# EAGLE design Calunium_PSU_v1 (EAGLE 6.4)
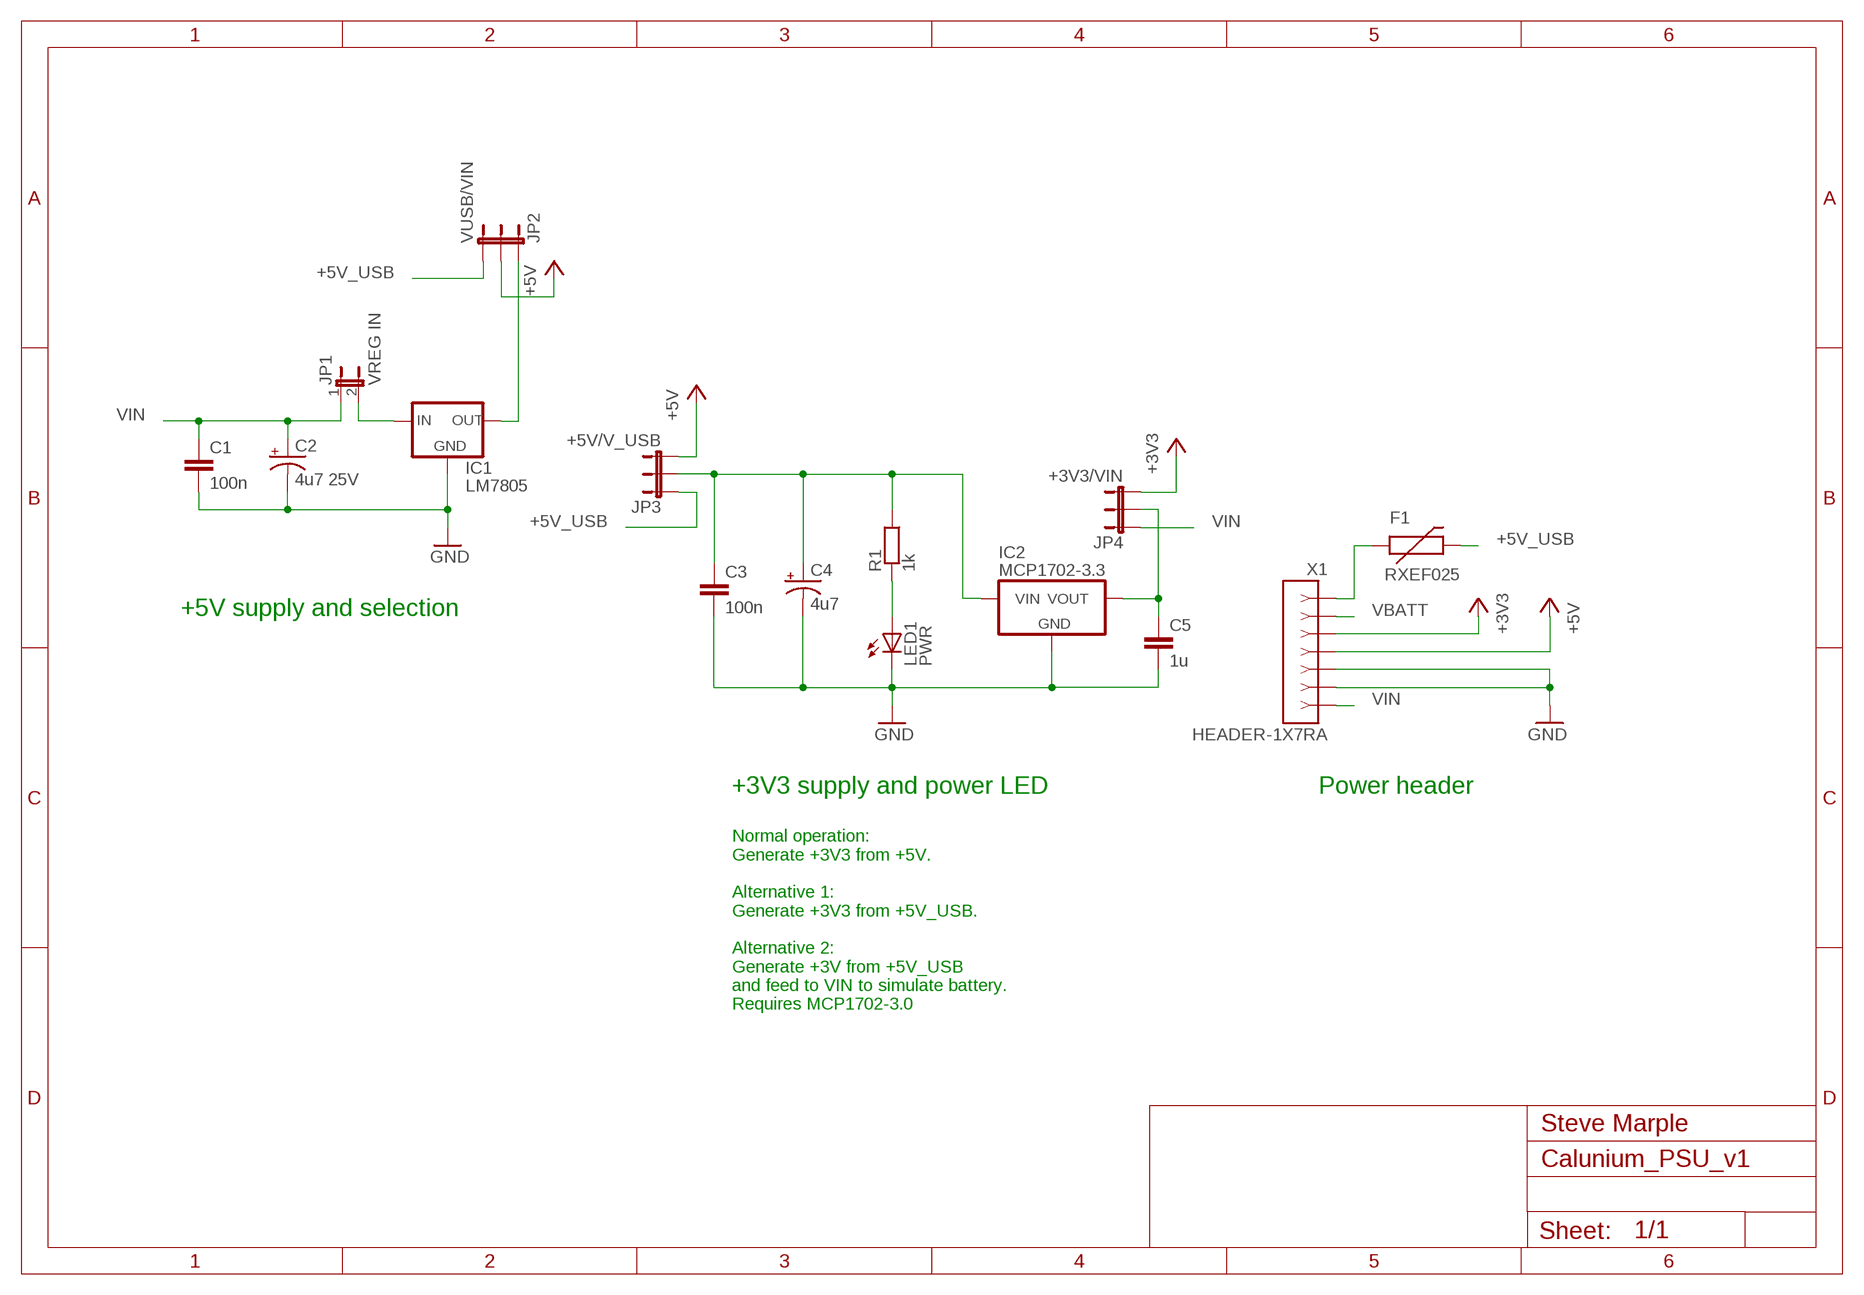
[diagram p0: schematic, sheet 1]

## Parts
C1  100n  CAPPTH  [CAP-PTH-SMALL]
C2  4u7 25V  CAP_POLPTH2  [CPOL-RADIAL-10UF-25V]
C3  100n  CAPPTH  [CAP-PTH-SMALL]
C4  4u7  CAP_POLPTH2  [CPOL-RADIAL-10UF-25V]
C5  1u  CAPPTH1  [CAP-PTH-5MM]
F1  RXEF025  PTCPTH  [PTC]
IC1  LM7805  V_REG_78XXSIDE-NO-HOLE  [78XXL-NO-HOLE]
IC2  MCP1702-3.3  MCP1702  [TO-92]
JP1  VREG IN  JUMPER-2PTH  [1X02]
JP2  VUSB/VIN  JUMPER-3PTH  [1X03]
JP3  +5V/V_USB  JUMPER-3SMD  [SJ_3]
JP4  +3V3/VIN  JUMPER-3SMD  [SJ_3]
LED1  PWR  LED3MM  [LED3MM]
R1  1k  RESISTOR  [RES-AXIAL-0.4]
X1  HEADER-1X7RA  [HEADER-1X7-RA]

## Nets
+3V3 [power]: JP4.3 X1.3
+5V [power]: JP2.2 JP3.3 X1.4
+5V_USB [power]: F1.P$2 JP2.3 JP3.1
GND [power]: C1.2 C2.2(-) C3.2 C4.2(-) C5.2 IC1.GND IC2.1(GND) LED1.K(C) X1.5 X1.6
N$1 [power]: F1.P$1 X1.1
N$2 [power]: IC1.IN JP1.2
N$3 [power]: IC1.OUT JP2.1
N$4 [power]: C3.1 C4.1(+) IC2.2(VIN) JP3.2 R1.P$2
N$5 [power]: C5.1 IC2.3(VOUT) JP4.2
N$8: LED1.A R1.P$1
VBATT [power]: X1.2
VIN [power]: C1.1 C2.1(+) JP1.1 JP4.1 X1.7

## Notes on the sheet
- +5V supply and selection
- +3V3 supply and power LED | Power header
- Normal operation:
  Generate +3V3 from +5V.
  
  Alternative 1:
  Generate +3V3 from +5V_USB.
  
  Alternative 2:
  Generate +3V from +5V_USB
  and feed to VIN to simulate battery.
  Requires MCP1702-3.0
- Steve Marple

## Library data of the parts
C1 C3 C5 = SparkFun:CAP: Capacitor Standard 0603 ceramic capacitor, and 0.1" leaded capacitor.
C2 C4 = SparkFun:CAP_POL: Capacitor Polarized These are standard SMD and PTH capacitors. Normally 10uF, 47uF, and 100uF in electrolytic and tantalum varieties. Always verify the external diameter of the through hole cap, it varies with capacity, voltage, and manufacturer. The EIA devices should be standard.
F1 = SparkFun:PTC: Resettable Fuse PTC Resettable Fuse. Spark Fun Electronics SKU : COM-08357
IC1 = SteveMarple:V_REG_78XX: Voltage Regulator Standard 7805 5V regulator. IGO (Input Ground Output). Spark Fun Electronics SKU : COM-00107
IC2 = SteveMarple:MCP1702: Microchip MCP1702 250mA loq quiescent current (2uA) LDO voltage regulator.
JP1 = SparkFun:JUMPER-2: Jumper Basic 0.1" spaced jumper. Use with breakaway headers.
JP2-JP4 = SparkFun:JUMPER-3
LED1 = SparkFun:LED: LEDs Standard schematic elements and footprints for 5mm, 3mm, 1206, and 0603 sized LEDs. 5mm - Spark Fun Electronics SKU : COM-00529 (and others)
R1 = SteveMarple:RESISTOR: 1/4W PTH resistor
X1 = SteveMarple:HEADER-1X7

## Net classes
1 power: width 0.381 mm
3 antenna: width 0.61 mm

## Board
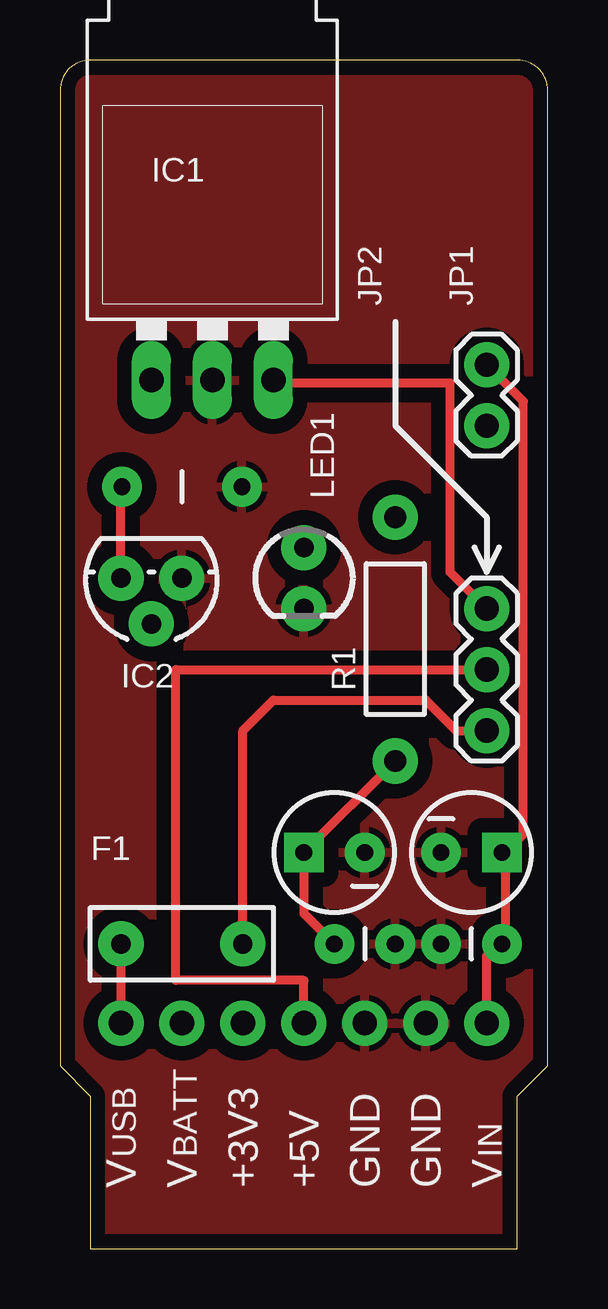
[diagram p1: board, top side]
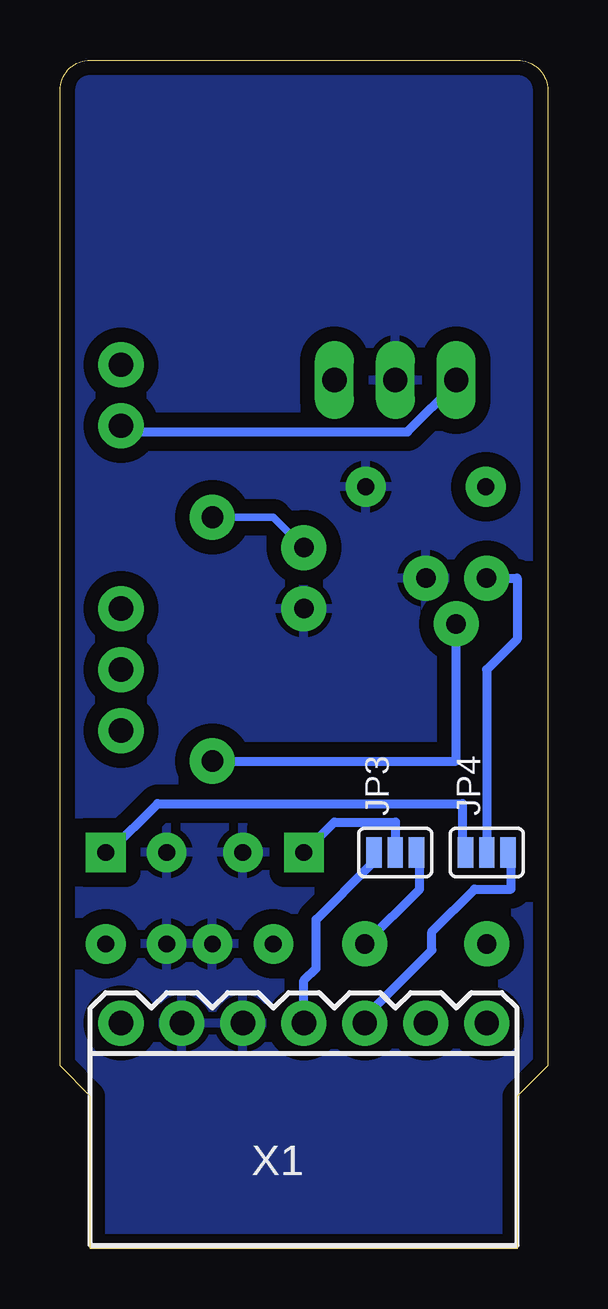
[diagram p2: board, bottom side, seen from below]

Size 20.32 x 49.53 mm. Coordinates in mm from the lower left corner, seen from the top.
Outline: 1.27,0 19.05,0 19.05,6.35 20.32,7.62 20.32,48.26 arc90 19.05,49.53 1.27,49.53 arc90 0,48.26 0,7.62 1.27,6.35 1.27,0
Copper layers (1*16): Top 0.035mm / dielectric 1.5mm / Bottom 0.035mm
Design rules "SparkFun_Iteadstudio_10mil": minimum track width 10mil, minimum drill 20mil, track to track 10mil, track to pad 10mil, pad to pad 10mil, via to via 10mil, smd to smd 10mil, copper to edge 0.5mm, drill to drill 8mil, minimum pad ring 12mil, minimum via ring 10mil, stop-mask expansion 4mil, vias tented up to drill 25mil, thermal gap 10mil

### Footprints (pad centres in the part's own frame; a part is rotated, then mirrored left to right if it is on the bottom)
CAP-PTH-SMALL = drill 0.7 pad 1.651: 1 0,0; 2 2.54,0
CPOL-RADIAL-10UF-25V = drill 0.7 pad 1.651 square: 1 1.27,0 | drill 0.7 pad 1.651: 2 -1.27,0
CAP-PTH-5MM = drill 0.7 pad 1.651: 1 -2.5,0; 2 2.5,0
PTC = drill 0.8 pad 1.88: P$1 -2.54,0; P$2 2.54,0
78XXL-NO-HOLE = drill 1.016 long: GND 0,-3.81; IN -2.54,-3.81; OUT 2.54,-3.81
TO-92 = drill 0.813 pad 1.88: 1 -1.27,0; 2 0,1.905; 3 1.27,0
1X02 = drill 1.016 pad 1.88: 1 0,0; 2 2.54,0
1X03 = drill 1.016 pad 1.88: 1 0,0; 2 2.54,0; 3 5.08,0
SJ_3 = smd 0.635 x 1.27: 1 -0.889,0; 2 0,0; 3 0.889,0
LED3MM = drill 0.813 pad 1.88: A -1.27,0; K 1.27,0
RES-AXIAL-0.4 = drill 0.9 pad 1.88: P$1 -5.08,0; P$2 5.08,0
HEADER-1X7-RA = drill 1.016 pad 1.88: 1 -7.62,0; 2 -5.08,0; 3 -2.54,0; 4 0,0; 5 2.54,0; 6 5.08,0; 7 7.62,0

### Placement (x,y rotation side)
C1  18.41,12.7 180 top
C2  17.14,16.51 0 top
C3  11.43,12.7 0 top
C4  11.43,16.51 180 top
C5  5.08,31.75 0 top
F1  5.08,12.7 0 top
IC1  6.35,40.01 0 top
IC2  3.81,27.94 180 top
JP1  17.78,36.83 270 top
JP2  17.78,26.67 270 top
JP3  6.35,16.51 180 bottom
JP4  2.54,16.51 0 bottom
LED1  10.16,27.94 270 top
R1  13.97,25.4 270 top
X1  10.16,9.4 180 bottom

### Tracks (layer width: path | path; a pad name or v marks a point on that pad's centre or on a via)
+3V3
  Bottom 0.381: X1.3 7.62,9.65 4.83,12.45 4.83,13.21 3.05,14.99 1.52,14.99 1.52,16.51 JP4.3
+5V
  Top 0.381: JP2.2 4.83,24.13 4.83,11.18 10.16,11.18 X1.4
  Bottom 0.381: X1.4 10.16,11.18 9.65,11.68 9.65,13.72 7.37,16 7.37,16.51 JP3.3
+5V_USB
  Top 0.381: JP2.3 16.51,21.59 15.24,22.86 8.89,22.86 7.62,21.59 F1.P$2
  Bottom 0.381: F1.P$2 5.33,14.99 5.33,16.51 JP3.1
GND
  pour Top (isolate 0.61): -2.54,-2.54 -2.54,52.07 22.86,52.07 22.86,-2.54
  pour Bottom (isolate 0.61): -1.27,-1.27 -1.27,50.8 21.59,50.8 21.59,-1.27
N$1
  Top 0.381: F1.P$1 X1.1
N$2
  Bottom 0.381: JP1.2 17.53,34.04 5.84,34.04 3.81,36.07 IC1.IN
N$3
  Top 0.381: JP2.1 16.26,28.19 16.26,36.07 8.89,36.07 IC1.OUT
N$4
  Top 0.381: C3.1 10.16,13.97 C4.1 R1.P$2
  Bottom 0.381: JP3.2 6.35,17.78 8.89,17.78 C4.1 | IC2.2 3.81,20.32 R1.P$2
N$5
  Top 0.381: IC2.3 2.54,31.75 C5.1
  Bottom 0.381: JP4.2 2.54,24.13 1.27,25.4 1.27,27.94 IC2.3
N$8
  Bottom 0.305: LED1.A 11.43,30.48 R1.P$1
VIN
  Top 0.381: X1.7 17.78,12.19 18.29,12.7 C1.1 18.54,12.7 18.54,16.51 | JP1.1 19.3,35.31 19.3,17.27 18.54,16.51 | 18.54,16.51 C2.1
  Bottom 0.381: JP4.1 3.56,16.51 3.56,18.54 16.26,18.54 18.29,16.51 C2.1

### Text on the board
_tsilk: USB | BATT | IN | V | V | +3V3 | +5V | GND | GND | V